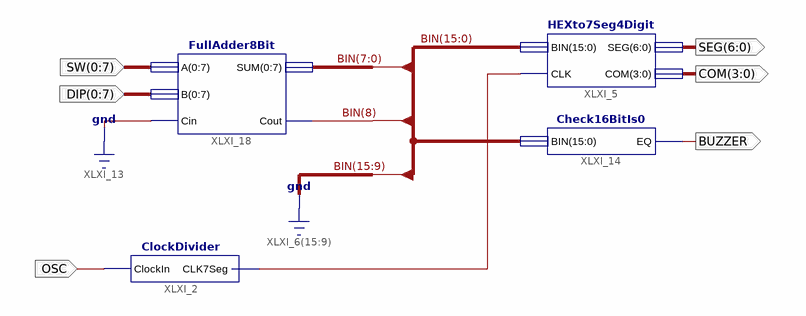
[diagram p0: schematic sheet 1]
// Xilinx ISE schematic Adder.sch (spartan6) as structural Verilog: 4 symbols, 6 ports
module Adder (
  input  OSC,
  input  [0:7] SW,
  input  [0:7] DIP,
  output [6:0] SEG,
  output [3:0] COM,
  output BUZZER
);

  wire XLXN_9;
  wire [8:0] BIN;

  ClockDivider XLXI_2 (.ClockIn(OSC), .CLK7Seg(XLXN_9));
  HEXto7Seg4Digit XLXI_5 (.BIN({{7{1'b0}}, BIN}), .CLK(XLXN_9), .SEG(SEG), .COM(COM));
  Check16BitIs0 XLXI_14 (.BIN({{7{1'b0}}, BIN}), .EQ(BUZZER));
  FullAdder8Bit XLXI_18 (.A(SW), .B(DIP), .Cin(1'b0), .SUM(BIN[7:0]), .Cout(BIN[8]));
endmodule
